# Altium schematic sheet 17.Other.SchDoc
size A4; CheckedBy: YPC; DocumentNumber: 17; Revision: V1.00; SheetNumber: 17; SheetTotal: 18; SheetName: Other; SheetDescribe: other; Designer: JOW; DesignDate: 2025-04-25; CheckedData: 2025-04-25
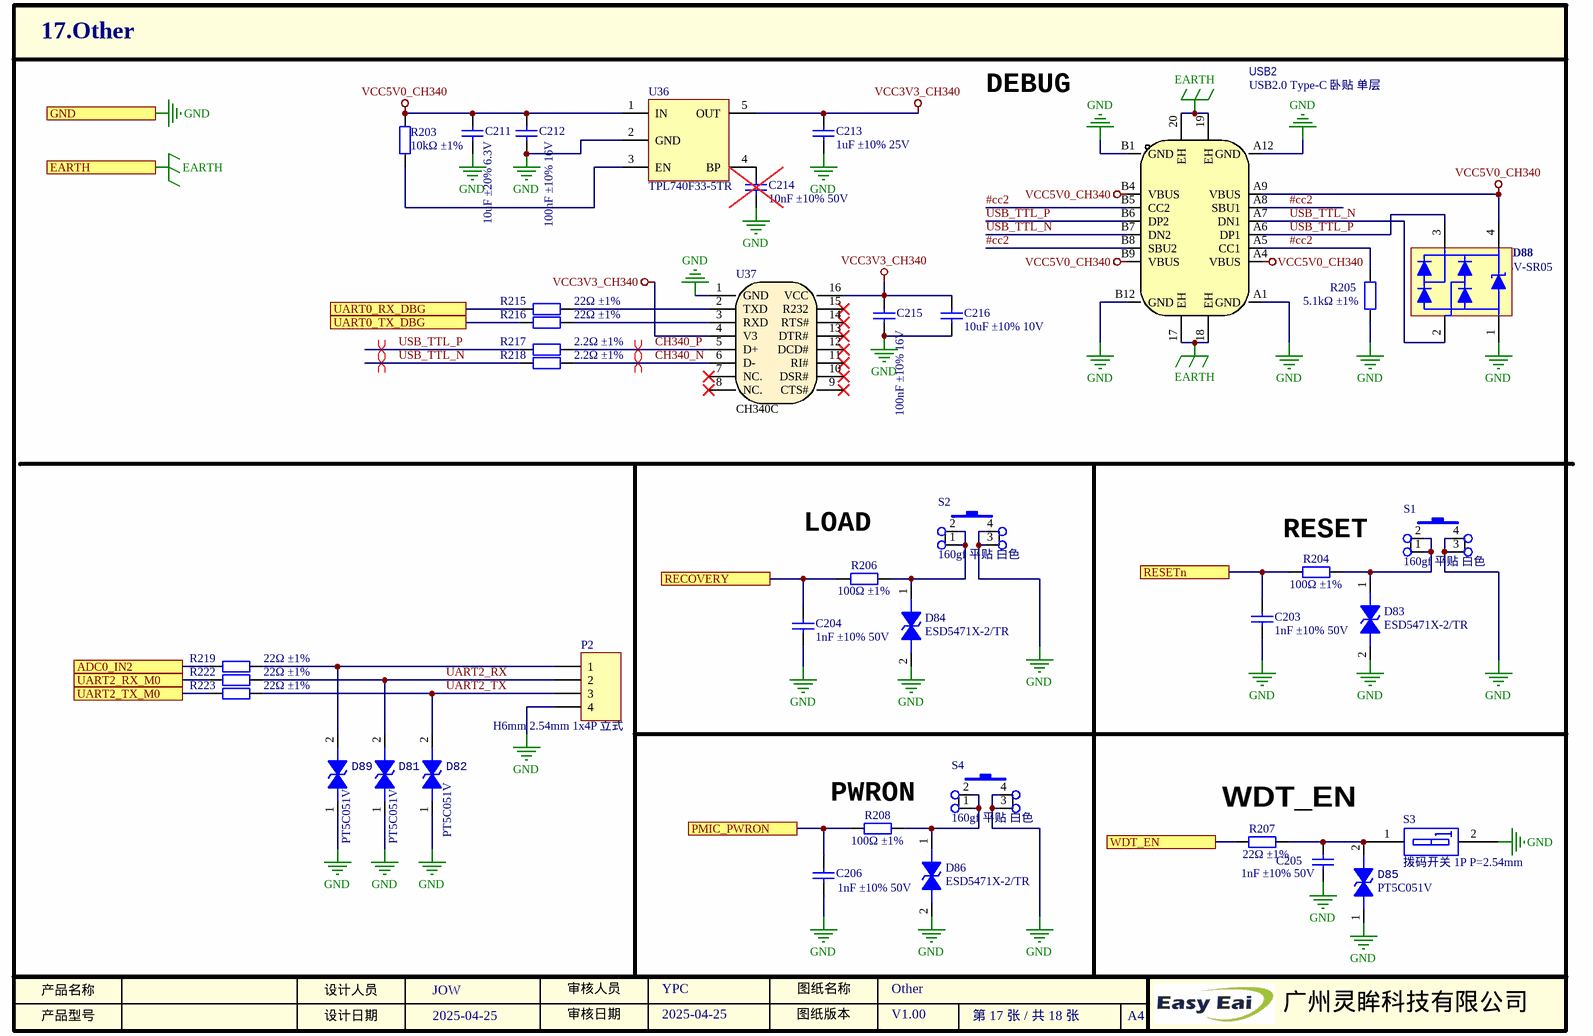
[diagram p0: 17.Other.SchDoc]

## Parts
C203  描述: 1nF ±10% 50V  [0402_C]  (hidden comment: 0402B102K500NT)
C204  描述: 1nF ±10% 50V  [0402_C]  (hidden comment: 0402B102K500NT)
C205  描述: 1nF ±10% 50V  [0402_C]  (hidden comment: 0402B102K500NT)
C206  描述: 1nF ±10% 50V  [0402_C]  (hidden comment: 0402B102K500NT)
C211  描述: 10uF ±20% 6.3V  [0402_C]  (hidden comment: CL05A106MQ5NUNC)
C212  描述: 100nF ±10% 16V  [0402_C]  (hidden comment: CL05B104KO5NNNC)
C213  描述: 1uF ±10% 25V  [0402_C]  (hidden comment: CL05A105KA5NQNC)
C214  描述: 10nF ±10% 50V  [0402_C]  (hidden comment: NC/CL05B103KB5NNNC)  (no BOM)
C215  描述: 100nF ±10% 16V  [0402_C]  (hidden comment: CL05B104KO5NNNC)
C216  描述: 10uF ±10% 10V  [0603_C]  (hidden comment: CL10A106KP8NNNC)
D81  PT5C051V  [SOD-523]
D82  PT5C051V  [SOD-523]
D83  ESD5471X-2/TR  [FBP-02C]
D84  ESD5471X-2/TR  [FBP-02C]
D85  PT5C051V  [SOD-523]
D86  ESD5471X-2/TR  [FBP-02C]
D88  BV-SR05  [SOT-143]
D89  PT5C051V  [SOD-523]
P2  描述: H6mm 2.54mm 1x4P 立式  [HDR-TH_4P-P2.54-V-M]  (hidden comment: 2.54-1x4P直针)
R203  描述: 10kΩ ±1%  [0402_R]  (hidden comment: 0402WGF1002TCE)
R204  描述: 100Ω ±1%  [0402_R]  (hidden comment: 0402WGF1000TCE)
R205  描述: 5.1kΩ ±1%  [0402_R]  (hidden comment: 0402WGF5101TCE)
R206  描述: 100Ω ±1%  [0402_R]  (hidden comment: 0402WGF1000TCE)
R207  描述: 22Ω ±1%  [0402_R]  (hidden comment: 0402WGF220JTCE)
R208  描述: 100Ω ±1%  [0402_R]  (hidden comment: 0402WGF1000TCE)
R215  描述: 22Ω ±1%  [0402_R]  (hidden comment: 0402WGF220JTCE)
R216  描述: 22Ω ±1%  [0402_R]  (hidden comment: 0402WGF220JTCE)
R217  描述: 2.2Ω ±1%  [0402_R]  (hidden comment: 0402WGF220KTCE)
R218  描述: 2.2Ω ±1%  [0402_R]  (hidden comment: 0402WGF220KTCE)
R219  描述: 22Ω ±1%  [0402_R]  (hidden comment: 0402WGF220JTCE)
R222  描述: 22Ω ±1%  [0402_R]  (hidden comment: 0402WGF220JTCE)
R223  描述: 22Ω ±1%  [0402_R]  (hidden comment: 0402WGF220JTCE)
S1  描述: 160gf 平贴 白色  [SW-SMD_4P-L4.2-W3.2-P2.15-LS5.2]  (hidden comment: TS-1145A-B-A)
S2  描述: 160gf 平贴 白色  [SW-SMD_4P-L4.2-W3.2-P2.15-LS5.2]  (hidden comment: TS-1145A-B-A)
S3  EM-01KP  [EM-01KP]  (value not drawn)
S4  描述: 160gf 平贴 白色  [SW-SMD_4P-L4.2-W3.2-P2.15-LS5.2]  (hidden comment: TS-1145A-B-A)
U36  TPL740F33-5TR  [SOT-23-5]
U37  CH340C  [SOIC-16_150mil]
USB2  USB2.0 Type-C 卧贴 单层  [USB-TYPE-C_16PIN-MALE-TYPE-C-31-M-12]

## Ports
ADC0_IN2, EARTH, GND, PMIC_PWRON, RECOVERY, RESETn, UART0_RX_DBG, UART0_TX_DBG, UART2_RX_M0, UART2_TX_M0, WDT_EN

## Nets
EARTH: USB2.17(EH) USB2.18(EH) USB2.19(EH) USB2.20(EH) ; port EARTH
GND: C203.1 C204.1 C205.1 C206.1 C211.1 C212.1 C213.1 C214.1 C215.1 C216.1 D81.1 D82.1 D83.2 D84.2 D85.1 D86.2 D88.1 D89.1 P2.4 R205.1 S1.3 S1.4 S2.3 S2.4 S3.2 S4.3 S4.4 U36.2(GND) U37.1(GND) USB2.A1(GND) USB2.A12(GND) USB2.B1(GND) USB2.B12(GND) ; port GND
VCC3V3_CH340: C213.2 C215.2 C216.2 U36.5(OUT) U37.4(V3) U37.16(VCC)
VCC5V0_CH340: C211.2 C212.2 D88.4 R203.2 U36.1(IN) USB2.A4(VBUS) USB2.A9(VBUS) USB2.B4(VBUS) USB2.B9(VBUS)
#cc2: R205.2 USB2.A5(CC1) USB2.A8(SBU1) USB2.B5(CC2) USB2.B8(SBU2)
ADC0_IN2: R219.1 ; port ADC0_IN2
CH340_N: R218.2 U37.6(D-)
CH340_P: R217.2 U37.5(D+)
PMIC_PWRON: C206.2 R208.1 ; port PMIC_PWRON
RECOVERY: C204.2 R206.1 ; port RECOVERY
RESETn: C203.2 R204.1 ; port RESETn
UART0_RX_DBG: R215.1 ; port UART0_RX_DBG
UART0_TX_DBG: R216.1 ; port UART0_TX_DBG
UART2_RX: D81.2 P2.2 R222.2
UART2_RX_M0: R222.1 ; port UART2_RX_M0
UART2_TX: D82.2 P2.3 R223.2
UART2_TX_M0: R223.1 ; port UART2_TX_M0
USB_TTL_N: D88.2 R218.1 USB2.A7(DN1) USB2.B7(DN2)
USB_TTL_P: D88.3 R217.1 USB2.A6(DP1) USB2.B6(DP2)
WDT_EN: R207.1 ; port WDT_EN
NetC205_2: C205.2 D85.2 R207.2 S3.1
NetC214_2: C214.2 U36.4(BP)
NetD83_1: D83.1 R204.2 S1.1 S1.2
NetD84_1: D84.1 R206.2 S2.1 S2.2
NetD86_1: D86.1 R208.2 S4.1 S4.2
NetD89_2: D89.2 P2.1 R219.2
NetR203_1: R203.1 U36.3(EN)
NetR215_2: R215.2 U37.2(TXD)
NetR216_2: R216.2 U37.3(RXD)

Not connected (* = marked no-connect by the designer): U37 7(NC.)* 8(NC.)* 9(CTS#)* 10(DSR#)* 11(RI#)* 12(DCD#)* 13(DTR#)* 14(RTS#)* 15(R232)*

## Layout directives
differential pair: CH340_N, CH340_P, USB_TTL_N, USB_TTL_P

## Notes on the sheet
- DEBUG
- (near R206) LOAD
- (near R204) RESET
- (near R208) PWRON
- WDT_EN
- 产品名称
- 产品型号
- 设计人员
- 设计日期
- 审核人员
- 审核日期
- 图纸版本
- 图纸名称
- A4
- 广州灵眸科技有限公司

## Library data of the parts
C203-C206 = 0402 1nF ±10% 50V: SPZL000264; 名称: 贴片电容; 厂商: FH(风华); 封装: 0402; 工作温度: -55~125℃; 贴片和直插: SMD; 型号: 0402B102K500NT; SuppliersPartNumber: C1523; 商品编号: SPZL000264
C211 = 0402 10uF ±20% 6.3V: SPZL000269; 名称: 贴片电容; 厂商: SAMSUNG(三星); 封装: 0402; 工作温度: -55~85℃; 贴片和直插: SMD; 型号: CL05A106MQ5NUNC; SuppliersPartNumber: C15525; 商品编号: SPZL000269
C212 C215 = 0402 100nF ±10% 16V: SPZL000259; 名称: 贴片电容; 厂商: SAMSUNG(三星); 封装: 0402; 工作温度: -55~125℃; 贴片和直插: SMD; 型号: CL05B104KO5NNNC; SuppliersPartNumber: C1525; 商品编号: SPZL000259
C213 = 0402 1uF ±10% 25V: SPZL000337; 名称: 贴片电容; 厂商: SAMSUNG(三星); 封装: 0402; 工作温度: -55~85℃; 贴片和直插: SMD; 型号: CL05A105KA5NQNC; SuppliersPartNumber: C52923; 商品编号: SPZL000337
C214 = 0402 10nF ±10% 50V: SPZL000342; 名称: 贴片电容; 厂商: SAMSUNG(三星); 封装: 0402; 工作温度: -55~125℃; 贴片和直插: SMD; 型号: CL05B103KB5NNNC; SuppliersPartNumber: C15195; 商品编号: SPZL000342
C216 = 0603 10uF ±10% 10V: SPZL000260; 名称: 贴片电容; 厂商: SAMSUNG(三星); 封装: 0603; 工作温度: -55~85℃; 贴片和直插: SMD; 型号: CL10A106KP8NNNC; SuppliersPartNumber: C19702; 商品编号: SPZL000260
D81 D82 D85 D89 = PT5C051V: SPZL001155; 名称: ESD; 贴片和直插: SMD; 厂商: 玛珂斯科技; 描述: Vrwm=5V,Vc=25V,Ipp=5A; 工作温度: -55~125℃; 封装: SOD-523; 商品编号: SPZL001155; 型号: PT5C051V
D83 D84 D86 = TVS ESD5471X-2/TR: SPZL000254; 名称: TVS; 贴片和直插: SMD; 厂商: WillSemi(韦尔半导体); 描述: Vdrm=5V Cj=9pF; 工作温度: -40~85℃; SuppliersPartNumber: C239631; 封装: FBP-02C; 商品编号: SPZL000254; 型号: ESD5471X-2/TR
D88 = TVS BV-SR05: SPZL000616; 名称: TVS; 厂商: Bencent(槟城); 贴片和直插: SMD; 描述: Vdrm=5V Cj=0.85pF; 工作温度: -40~125℃; 封装: SOT-143; SuppliersPartNumber: C413946; 商品编号: SPZL000616; 型号: BV-SR05
P2 = 排针 H6mm 2.54mm 1x4P 立式: SPZL001463; 名称: 排针; 贴片和直插: THT; 厂商: XFCN(兴飞); 封装: 插件,P=2.54mm; 工作温度: -40~105℃; 型号: 2.54-1x4P直针; 商品编号: SPZL001463; SuppliersPartNumber: C2691448
R203 = 0402 10kΩ ±1%: SPZL000271; 封装: 0402; 厂商: UNI-ROYAL(厚声); 贴片和直插: SMD; 名称: 电阻; 工作温度: -55~155℃; SuppliersPartNumber: C25744; 型号: 0402WGF1002TCE; 商品编号: SPZL000271
R204 R206 R208 = 0402 100Ω ±1%: SPZL000281; 封装: 0402; 厂商: UNI-ROYAL(厚声); 贴片和直插: SMD; 名称: 电阻; 工作温度: -55~155℃; SuppliersPartNumber: C25076; 型号: 0402WGF1000TCE; 商品编号: SPZL000281
R205 = 0402 5.1kΩ ±1%: SPZL000270; 封装: 0402; 厂商: UNI-ROYAL(厚声); 贴片和直插: SMD; 名称: 电阻; 工作温度: -55~155℃; SuppliersPartNumber: C25905; 型号: 0402WGF5101TCE; 商品编号: SPZL000270
R207 R215 R216 R219 R222 R223 = 0402 22Ω ±1%: SPZL000279; 封装: 0402; 厂商: UNI-ROYAL(厚声); 贴片和直插: SMD; 名称: 电阻; 工作温度: -55~155℃; SuppliersPartNumber: C25092; 型号: 0402WGF220JTCE; 商品编号: SPZL000279
R217 R218 = 0402 2.2Ω ±1%: SPZL000327; 封装: 0402; 厂商: UNI-ROYAL(厚声); 贴片和直插: SMD; 名称: 电阻; 工作温度: -55~155℃; SuppliersPartNumber: C25101; 型号: 0402WGF220KTCE; 商品编号: SPZL000327
S1 S2 S4 = 轻触开关 3.2X4.2X2.5mm: SPZL000455; 名称: 轻触开关; 贴片和直插: SMD; 厂商: XKB Connectivity; 封装: SMD 3.2X4.2X2.5mm; 工作温度: -30~85℃; SuppliersPartNumber: C318904; 型号: TS-1145A-B-A; 商品编号: SPZL000455
S3 = 拨码开关 1P P=2.54mm: SPZL000149; 名称: 拨码开关; 贴片和直插: SMD; 厂商: 韩国韩荣; 封装: SMD,2.5x6mm; 工作温度: -20~70℃; SuppliersPartNumber: C129077; 型号: EM-01KP; 商品编号: SPZL000149; 描述: 拨码开关 1P P=2.54mm
U36 = TPL740F33-5TR: SPZL000784; 名称: 电源IC; 厂商: 3PEAK; 贴片和直插: SMD; 描述: LDO; 工作温度: -40~85℃; 封装: SOT-23-5; SuppliersPartNumber: *; 商品编号: SPZL000784; 型号: TPL740F33-5TR
U37 = CH340C: SPZL000072; 名称: IC; 封装: SOP-16_150mil; 描述: USB/TTL; 厂商: WCH(南京沁恒); 贴片和直插: SMD; 工作温度: -20~70℃; 商品编号: SPZL000072; SuppliersPartNumber: C84681; 型号: CH340C
USB2 = USB2.0 Type-C 卧贴 单层: SPZL000132; 厂商: 韩国韩荣; 名称: USB连接器; 封装: SMD; 型号: TYPE-C-31-M-12; 贴片和直插: SMD; 商品编号: SPZL000132; SuppliersPartNumber: C165948; 描述: USB2.0 Type-C 卧贴 单层